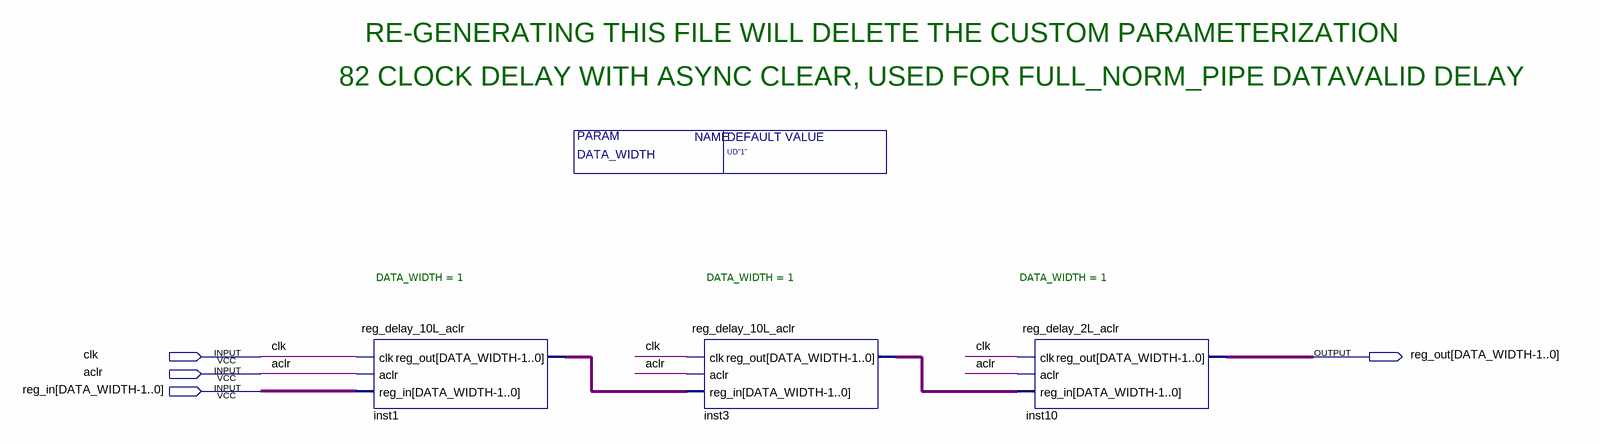
[diagram p0: schematic sheet]
// Quartus schematic reg_delay_22L_aclr.bdf as structural Verilog: 3 symbols, 4 pins
module reg_delay_22L_aclr #(parameter DATA_WIDTH = "UD\"1\"") (
  input  clk,
  input  aclr,
  input  \reg_in[DATA_WIDTH-1..0] ,
  output \reg_out[DATA_WIDTH-1..0] 
);

  wire inst1_reg_out, inst3_reg_out;

  reg_delay_10L_aclr #(.DATA_WIDTH(1)) inst1 (
    .clk(clk), .aclr(aclr), .reg_in(\reg_in[DATA_WIDTH-1..0] ), .reg_out(inst1_reg_out));
  reg_delay_10L_aclr #(.DATA_WIDTH(1)) inst3 (.clk(clk), .aclr(aclr), .reg_in(inst1_reg_out), .reg_out(inst3_reg_out));
  reg_delay_2L_aclr #(.DATA_WIDTH(1)) inst10 (
    .clk(clk), .aclr(aclr), .reg_in(inst3_reg_out), .reg_out(\reg_out[DATA_WIDTH-1..0] ));

  // Notes on the sheet:
  //   RE-GENERATING THIS FILE WILL DELETE THE CUSTOM PARAMETERIZATION
  //   82 CLOCK DELAY WITH ASYNC CLEAR, USED FOR FULL_NORM_PIPE DATAVALID DELAY
endmodule
